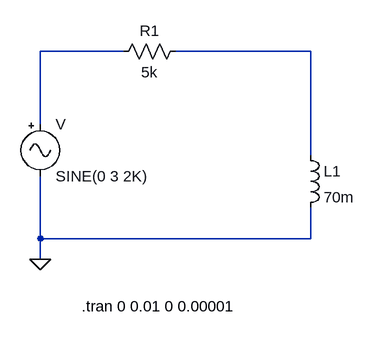
[diagram p0: schematic R__L.asc]
R__L.asc, the LTspice schematic file:
Version 4
SHEET 1 880 680
WIRE 144 16 16 16
WIRE 432 16 224 16
WIRE 16 128 16 16
WIRE 432 176 432 16
WIRE 16 304 16 208
WIRE 432 304 432 256
WIRE 432 304 16 304
WIRE 16 336 16 304
FLAG 16 336 0
SYMBOL Misc\\signal 16 112 R0
SYMATTR InstName V
SYMATTR Value SINE(0 3 2K)
SYMBOL res 240 0 R90
WINDOW 0 0 56 VBottom 2
WINDOW 3 32 56 VTop 2
SYMATTR InstName R1
SYMATTR Value 5k
SYMBOL ind 416 160 R0
SYMATTR InstName L1
SYMATTR Value 70m
TEXT 80 408 Left 2 !.tran 0 0.01 0 0.00001

The netlist it stands for:
* R__L.asc
V N001 0 SINE(0 3 2K)
R1 N002 N001 5k
L1 N002 0 70m
.tran 0 0.01 0 0.00001
.backanno
.end